# Altium schematic sheet Option_Humidity_Tempture_Sensor.SchDoc
size 297 x 209 mm
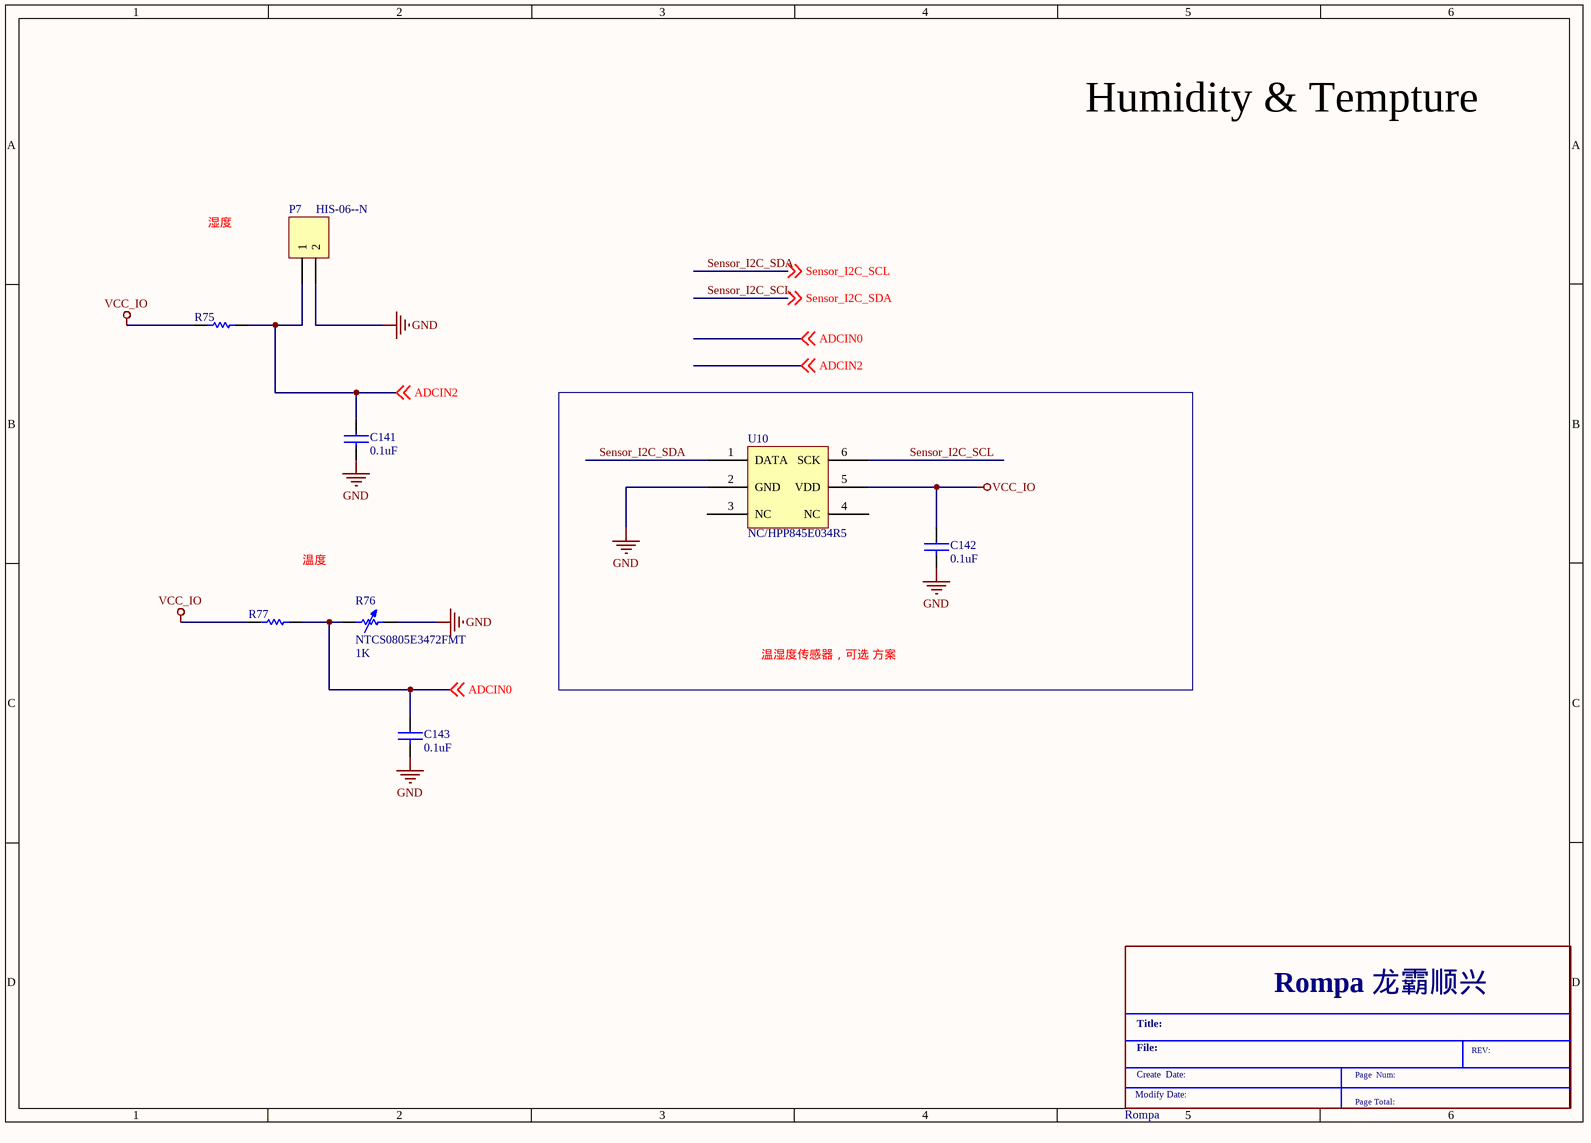
[diagram p0: Option_Humidity_Tempture_Sensor.SchDoc]

## Parts
*  Rompa  (graphical)
C141  0.1uF  [C0402]
C142  0.1uF  [C0402]
C143  0.1uF  [C0402]
P7  HIS-06--N  [HDR1X2]
R75  10K  [0603]  (value not drawn)
R76  NTCS0805E3472FMT  value 1K  [2012[0805]]
R77  10K  [0603]  (value not drawn)
U10  NC/HPP845E034R5

## Blocks framed on the sheet
温湿度传感器，可选 方案: C142 U10

## Nets
GND: C141.2 C142.2 C143.2 P7.2 R76.2 U10.2(GND)
VCC_IO: C142.1 R75.2 R77.2 U10.5(VDD)
ADCIN0: C143.1 R76.1 R77.1 ; off-sheet ADCIN0
ADCIN2: C141.1 P7.1 R75.1 ; off-sheet ADCIN2
Sensor_I2C_SCL: U10.1(DATA) U10.6(SCK) ; off-sheet Sensor_I2C_SDA, off-sheet Sensor_I2C_SCL  [also labelled Sensor_I2C_SDA]

Not connected (* = marked no-connect by the designer): U10 3(NC) 4(NC)

## Notes on the sheet
- Humidity & Tempture
- 湿度
- 温度
- (in symbol Rompa) Rompa 龙霸顺兴; Title:; File:; REV:; Create  Date:; Page  Num:; Modify Date:; Page Total:

## Library data of the parts
C141-C143 = CAP NP
P7 = Header 2: Humidity Resistor; LatestRevisionDate: 17-Jul-2002; LatestRevisionNote: Re-released for DXP Platform.; Publisher: Altium Limited
R75 R77 = Res1: Resistor; Published: 8-Jun-2000; LatestRevisionDate: 17-Jul-2002; LatestRevisionNote: Re-released for DXP Platform.; PackageReference: AXIAL-0.3; Publisher: Altium Limited; Value: 10K
R76 = Res Adj1: 4K7 NTC 1%; Set Position: 0.5; Published: 8-Jun-2000; LatestRevisionDate: 17-Jul-2002; LatestRevisionNote: Re-released for DXP Platform.; PackageReference: AXIAL-0.7; Publisher: Altium Limited
U10 = HPP845E034R5